# Altium schematic sheet BMSRev3.SchDoc: BMS
size 279 x 215 mm; CheckedBy: Farris Matar; Engineer: Josh Harper; Revision: 3; SheetNumber: 2; SheetTotal: 6
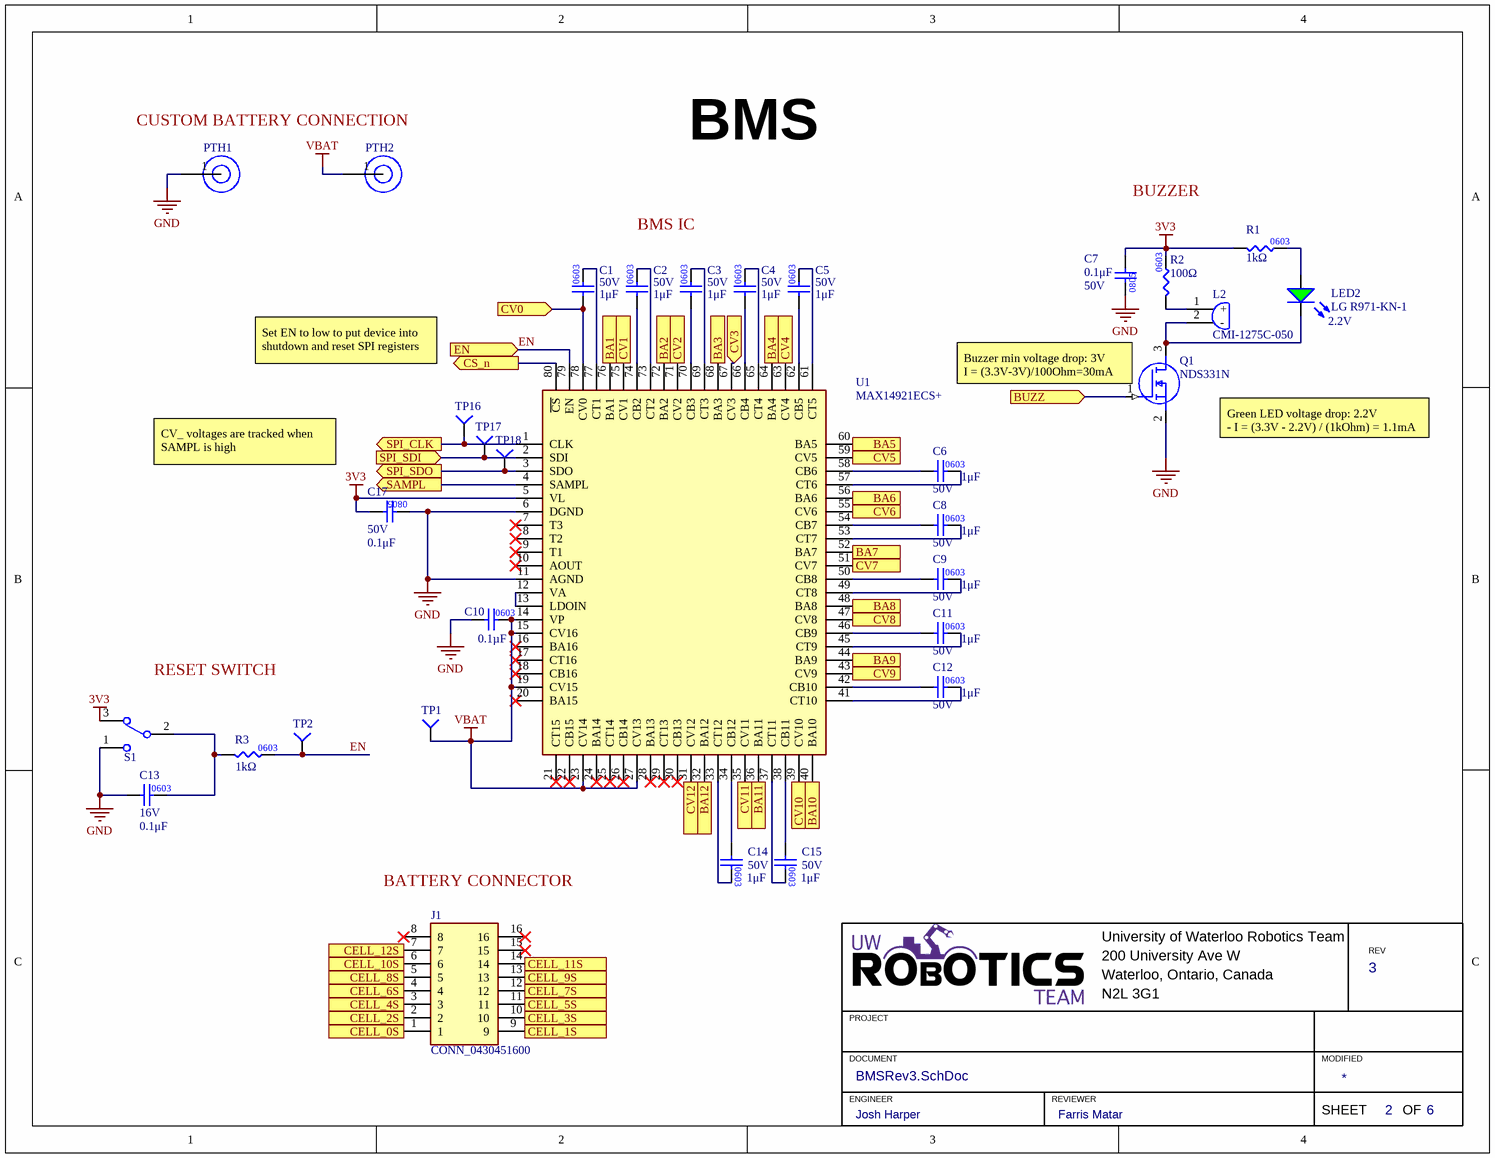
[diagram p0: BMSRev3.SchDoc]

## Parts
C1  value 1μF  Voltage Rating: 50V  [CAP0603]  (hidden comment: CAP_1uF_50V_0603)
C2  value 1μF  Voltage Rating: 50V  [CAP0603]  (hidden comment: CAP_1uF_50V_0603)
C3  value 1μF  Voltage Rating: 50V  [CAP0603]  (hidden comment: CAP_1uF_50V_0603)
C4  value 1μF  Voltage Rating: 50V  [CAP0603]  (hidden comment: CAP_1uF_50V_0603)
C5  value 1μF  Voltage Rating: 50V  [CAP0603]  (hidden comment: CAP_1uF_50V_0603)
C6  value 1μF  Voltage Rating: 50V  [CAP0603]  (hidden comment: CAP_1uF_50V_0603)
C7  value 0.1μF  Voltage Rating: 50V  [CAP2012]  (hidden comment: CAP_0.1uF_50V_0805)
C8  value 1μF  Voltage Rating: 50V  [CAP0603]  (hidden comment: CAP_1uF_50V_0603)
C9  value 1μF  Voltage Rating: 50V  [CAP0603]  (hidden comment: CAP_1uF_50V_0603)
C10  value 0.1µF  [CAP0603]  (hidden comment: CAP_0.1uF_10V_0603)
C11  value 1μF  Voltage Rating: 50V  [CAP0603]  (hidden comment: CAP_1uF_50V_0603)
C12  value 1μF  Voltage Rating: 50V  [CAP0603]  (hidden comment: CAP_1uF_50V_0603)
C13  value 0.1μF  Voltage Rating: 16V  [CAP0603]  (hidden comment: CAP_0.1uF_16V_0603)
C14  value 1μF  Voltage Rating: 50V  [CAP0603]  (hidden comment: CAP_1uF_50V_0603)
C15  value 1μF  Voltage Rating: 50V  [CAP0603]  (hidden comment: CAP_1uF_50V_0603)
C17  value 0.1μF  Voltage Rating: 50V  [CAP2012]  (hidden comment: CAP_0.1uF_50V_0805)
J1  CONN_0430451600  [0430451600]
L2  CMI-1275C-050  [CMI1275C050]
LED2  Forward Voltage Drop: 2.2V  Manufacturer Part Number 1: LG R971-KN-1  [LED_0805_GREEN]  (hidden comment: LED_GREEN)
PTH1  PTH  [PTH]  (value not drawn)
PTH2  PTH  [PTH]  (value not drawn)
Q1  NDS331N  [SOT95P251X112-3N]
R1  value 1kΩ  [RES0603]  (hidden comment: RES_1kΩ_0603_5%)
R2  value 100Ω  [RES0603]  (hidden comment: RES_100Ω_0603_1%)
R3  value 1kΩ  [RES0603]  (hidden comment: RES_1kΩ_0603_5%)
S1  SW_TOGGLE_SPDT  [100SP1T1B4M2QE]  (value not drawn)
TP1  TESTPOINT_1MM_SQUARE  [TESTPOINT_SQUARE_1MM]  (value not drawn)  (no BOM)
TP2  TESTPOINT_1MM_SQUARE  [TESTPOINT_SQUARE_1MM]  (value not drawn)  (no BOM)
TP16  TESTPOINT_1MM_SQUARE  [TESTPOINT_SQUARE_1MM]  (value not drawn)  (no BOM)
TP17  TESTPOINT_1MM_SQUARE  [TESTPOINT_SQUARE_1MM]  (value not drawn)  (no BOM)
TP18  TESTPOINT_1MM_SQUARE  [TESTPOINT_SQUARE_1MM]  (value not drawn)  (no BOM)
U1  MAX14921ECS+  [QFP50P1400X1400X120-80N]

## Ports
BA1 (out), BA2 (out), BA3 (out), BA4 (out), BA5 (out), BA6 (out), BA7 (out), BA8 (out), BA9 (out), BA10 (out), BA11 (out), BA12 (out), BUZZ (in), CELL_0S (out), CELL_1S (out), CELL_2S (out), CELL_3S (out), CELL_4S (out), CELL_5S (out), CELL_6S (out), CELL_7S (out), CELL_8S (out), CELL_9S (out), CELL_10S (out), CELL_11S (out), CELL_12S (out), CS_n (out), CV0 (in), CV1 (in), CV2 (in), CV3 (in), CV4 (in), CV5 (in), CV6 (in), CV7 (in), CV8 (in), CV9 (in), CV10 (in), CV11 (in), CV12 (in), EN (in), SAMPL (out), SPI_CLK (out), SPI_SDI (in), SPI_SDO (out)

## Nets
3V3: C7.2 C17.2 R1.1 R2.2 S1.3 U1.5(VL)
GND: C7.1 C10.1 C13.1 C17.1 PTH1.1 Q1.2(S) S1.1 U1.6(DGND) U1.11(AGND)
VBAT: C10.2 PTH2.1 TP1.1(=value) U1.14(VP) U1.15(CV16) U1.19(CV15) U1.23(CV14) U1.27(CV13)
BA1: U1.76(BA1) ; port BA1
BA2: U1.72(BA2) ; port BA2
BA3: U1.68(BA3) ; port BA3
BA4: U1.64(BA4) ; port BA4
BA5: U1.60(BA5) ; port BA5
BA6: U1.56(BA6) ; port BA6
BA7: U1.52(BA7) ; port BA7
BA8: U1.48(BA8) ; port BA8
BA9: U1.44(BA9) ; port BA9
BA10: U1.40(BA10) ; port BA10
BA11: U1.36(BA11) ; port BA11
BA12: U1.32(BA12) ; port BA12
BUZZ: Q1.1(G) ; port BUZZ
CELL_0S: J1.1 ; port CELL_0S
CELL_1S: J1.9 ; port CELL_1S
CELL_2S: J1.2 ; port CELL_2S
CELL_3S: J1.10 ; port CELL_3S
CELL_4S: J1.3 ; port CELL_4S
CELL_5S: J1.11 ; port CELL_5S
CELL_6S: J1.4 ; port CELL_6S
CELL_7S: J1.12 ; port CELL_7S
CELL_8S: J1.5 ; port CELL_8S
CELL_9S: J1.13 ; port CELL_9S
CELL_10S: J1.6 ; port CELL_10S
CELL_11S: J1.14 ; port CELL_11S
CELL_12S: J1.7 ; port CELL_12S
CS_n: U1.80(~{CS}) ; port CS_n
CV0: C1.1 U1.78(CV0) ; port CV0
CV1: U1.75(CV1) ; port CV1
CV2: U1.71(CV2) ; port CV2
CV3: U1.67(CV3) ; port CV3
CV4: U1.63(CV4) ; port CV4
CV5: U1.59(CV5) ; port CV5
CV6: U1.55(CV6) ; port CV6
CV7: U1.51(CV7) ; port CV7
CV8: U1.47(CV8) ; port CV8
CV9: U1.43(CV9) ; port CV9
CV10: U1.39(CV10) ; port CV10
CV11: U1.35(CV11) ; port CV11
CV12: U1.31(CV12) ; port CV12
EN: R3.2 TP2.1(=value) U1.79(EN) ; port EN
SAMPL: U1.4(SAMPL) ; port SAMPL
SPI_CLK: TP16.1(=value) U1.1(CLK) ; port SPI_CLK
SPI_SDI: TP17.1(=value) U1.2(SDI) ; port SPI_SDI
SPI_SDO: TP18.1(=value) U1.3(SDO) ; port SPI_SDO
NetC1_2: C1.2 U1.77(CT1)
NetC2_1: C2.1 U1.74(CB2)
NetC2_2: C2.2 U1.73(CT2)
NetC3_1: C3.1 U1.70(CB3)
NetC3_2: C3.2 U1.69(CT3)
NetC4_1: C4.1 U1.66(CB4)
NetC4_2: C4.2 U1.65(CT4)
NetC5_1: C5.1 U1.62(CB5)
NetC5_2: C5.2 U1.61(CT5)
NetC6_1: C6.1 U1.58(CB6)
NetC6_2: C6.2 U1.57(CT6)
NetC8_1: C8.1 U1.54(CB7)
NetC8_2: C8.2 U1.53(CT7)
NetC9_1: C9.1 U1.50(CB8)
NetC9_2: C9.2 U1.49(CT8)
NetC11_1: C11.1 U1.46(CB9)
NetC11_2: C11.2 U1.45(CT9)
NetC12_1: C12.1 U1.42(CB10)
NetC12_2: C12.2 U1.41(CT10)
NetC13_2: C13.2 R3.1 S1.2
NetC14_1: C14.1 U1.34(CB12)
NetC14_2: C14.2 U1.33(CT12)
NetC15_1: C15.1 U1.38(CB11)
NetC15_2: C15.2 U1.37(CT11)
NetL2_1: L2.1(+) R2.1
NetL2_2: L2.2(-) LED2.2(K) Q1.3(D)
NetLED2_1: LED2.1(A) R1.2
NetU1_12: U1.12(VA) U1.13(LDOIN)

Not connected (* = marked no-connect by the designer): J1 8* 15* 16*; U1 7(T3)* 8(T2)* 9(T1)* 10(AOUT)* 16(BA16)* 17(CT16)* 18(CB16)* 20(BA15)* 21(CT15)* 22(CB15)* 24(BA14)* 25(CT14)* 26(CB14)* 28(BA13)* 29(CT13)* 30(CB13)*

## Notes on the sheet
- CUSTOM BATTERY CONNECTION
- BMS IC
- BUZZER
- Set EN to low to put device into shutdown and reset SPI registers
- (near Q1) Buzzer min voltage drop: 3V
  I = (3.3V-3V)/100Ohm=30mA
- Green LED voltage drop: 2.2V
  - I = (3.3V - 2.2V) / (1kOhm) = 1.1mA
- CV_ voltages are tracked when SAMPL is high
- (near S1) RESET SWITCH
- (near J1) BATTERY CONNECTOR
- University of Waterloo Robotics Team
- 200 University Ave W
- REV
- PROJECT
- Waterloo, Ontario, Canada
- N2L 3G1
- DOCUMENT
- ENGINEER
- REVIEWER
- MODIFIED
- SHEET
- OF
- (in symbol CAP_0.1uF_10V_0603) 0603
- (in symbol CAP_1uF_50V_0603) 0603
- (in symbol RES_100Ω_0603_1%) 0603

## Library data of the parts
C1-C6 C8 C9 C11 C12 C14 C15 = CAP_1uF_50V_0603: CAP CER 1UF 50V X6S 0603; Manufacturer Part Number 1: C1608X6S1H105K080AC; Manufacturer 1: TDK Corporation; Supplier Part Number 1: 445-7424-1-ND; Supplier 1: Digi-Key; Dielectric: X6S
C7 C17 = CAP_0.1uF_50V_0805: CAP CER 0.1UF 50V X7R 0805; Manufacturer Part Number 1: GCM21BR71H104KA37K; Manufacturer 1: Murata Electronics; Package/Footprint: 0805; Supplier Part Number 1: 490-8049-1-ND; Supplier 1: Digi-Key; Dielectric: X7R; LCSC Part #: C49678; Mounting Type: SMD
C10 = CAP_0.1uF_10V_0603: CAP CER 0.1UF 10V X7R 0402; Manufacturer 1: Murata Electronics; Manufacturer Part Number 1: GRM155R71A104KA01D; Package/Footprint: 0402; Supplier 1: Digi-Key; Supplier Part Number 1: 490-6321-1-ND; Voltage Rating: 10V
C13 = CAP_0.1uF_16V_0603: CAP CER 0.1UF 16V X7R 0603; Manufacturer Part Number 1: CC0603KRX7R7BB104; Manufacturer 1: Yageo; Package/Footprint: 0603; Supplier Part Number 1: 311-1088-1-ND; Supplier 1: Digi-Key; Dielectric: X7R; LCSC Number: C108079
J1 = CONN_0430451600: Connector 16 Pin AJX; Manufacturer_Name: Molex; Datasheet Link: https://www.molex.com/pdm_docs/sd/430451600_sd.pdf; Height: 9.02mm; Arrow Part Number: 0430451600; Arrow Price/Stock: https://www.arrow.com/en/products/0430451600/molex; Manufacturer Part Number 1: 0430451600
L2 = CMI-1275C-050: Inductor; Manufacturer_Name: CUI Inc.; Datasheet Link: https://componentsearchengine.com/Datasheets/1/CMI-1275C-050.pdf; Height: 8mm; Mouser Part Number: 490-CMI-1275C-050; Mouser Price/Stock: https://www.mouser.co.uk/ProductDetail/CUI-Devices/CMI-1275C-050?qs=qCxwlXJ4fnyWvfqXc%252BNqAA%3D%3D; Arrow Part Number: CMI-1275C-050; Arrow Price/Stock: https://www.arrow.com/en/products/cmi-1275c-050/cui-inc; Manufacturer Part Number 1: CMI-1275C-050
LED2 = LED_GREEN: LED GREEN DIFFUSED 0805 SMD; Manufacturer 1: OSRAM; Package/Footprint: 0805; Supplier Part Number 1: 475-1410-1-ND; Supplier 1: Digi-Key; Mounting Type: SMD
Q1 = NDS331N: MOSFET (N-Channel); Manufacturer_Name: onsemi; Datasheet Link: https://www.onsemi.com/pub/Collateral/NDS331N-D.PDF; Height: 1.12mm; Mouser Part Number: 512-NDS331N; Mouser Price/Stock: https://www.mouser.co.uk/ProductDetail/ON-Semiconductor-Fairchild/NDS331N?qs=FOlmdCx%252BAA2del7Yv4IvDw%3D%3D; Manufacturer Part Number 1: NDS331N
R1 R3 = RES_1kΩ_0603_5%: RES 1K OHM 5% 1/10W 0603; Manufacturer 1: Yageo; Manufacturer Part Number 1: RC0603JR-071KL; Package/Footprint: 0603; Supplier Part Number 1: 311-1.0KGRCT-ND; Supplier 1: Digi-Key; Mounting Type: SMD; LCSC Number: C14676
R2 = RES_100Ω_0603_1%: RES 100 OHM 1% 1/10W 0603; Manufacturer 1: Yageo; Manufacturer Part Number 1: RC0603FR-07100RL; Supplier Part Number 1: 311-100HRCT-ND; Supplier 1: Digi-Key
S1 = SW_TOGGLE_SPDT: SWITCH TOGGLE SPDT 5A 120V; Manufacturer 1: E-Switch; Voltage Rating (DC): 28V; Package/Footprint: TH; Supplier 1: Digi-Key; Mounting Type: TH; Throw Configuration: SPDT; Supplier Part Number 1: EG2355-ND; Manufacturer Part Number 1: 100SP1T1B4M2QE
TP1 TP2 TP16-TP18 = TESTPOINT_1MM_SQUARE: TESTPOINT 1MM SQUARE
U1 = MAX14921ECS+: IC 16s BMS; Manufacturer_Name: Maxim Integrated; Datasheet Link: http://pdfserv.maximintegrated.com/package_dwgs/21-0072.PDF; Height: 1.2mm; Mouser Part Number: 700-MAX14921ECS+; Mouser Price/Stock: https://www.mouser.co.uk/ProductDetail/Maxim-Integrated/MAX14921ECS%2b?qs=Vwh6e7toGLhlnKi5DjCusg%3D%3D; Manufacturer Part Number 1: MAX14921ECS+